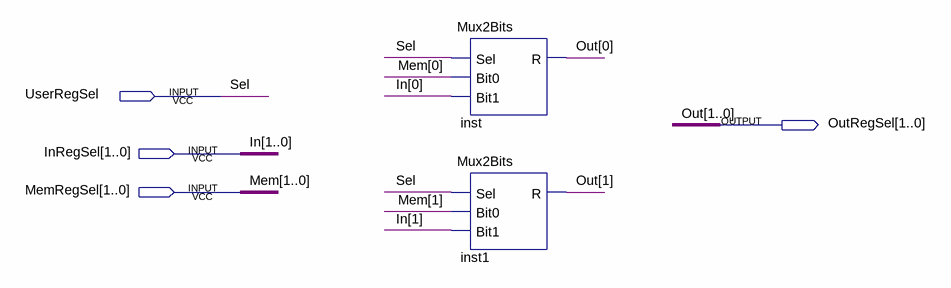
[diagram p0: schematic sheet]
// Quartus schematic RegSelUserMemMux.bdf as structural Verilog: 2 symbols, 4 pins
module RegSelUserMemMux (
  input  UserRegSel,
  input  [1:0] InRegSel,
  input  [1:0] MemRegSel,
  output [1:0] OutRegSel
);

  Mux2Bits inst (.Sel(UserRegSel), .Bit0(MemRegSel[0]), .Bit1(InRegSel[0]), .R(OutRegSel[0]));
  Mux2Bits inst1 (.Sel(UserRegSel), .Bit0(MemRegSel[1]), .Bit1(InRegSel[1]), .R(OutRegSel[1]));

  // Other names for the same wires on the sheet: In[1:0] = InRegSel; Mem[1:0] = MemRegSel; Out[1:0] = OutRegSel;
  //   Sel = UserRegSel
endmodule
